# EAGLE design IR_Signal_Conditioning-v1.0 (EAGLE 6.4)
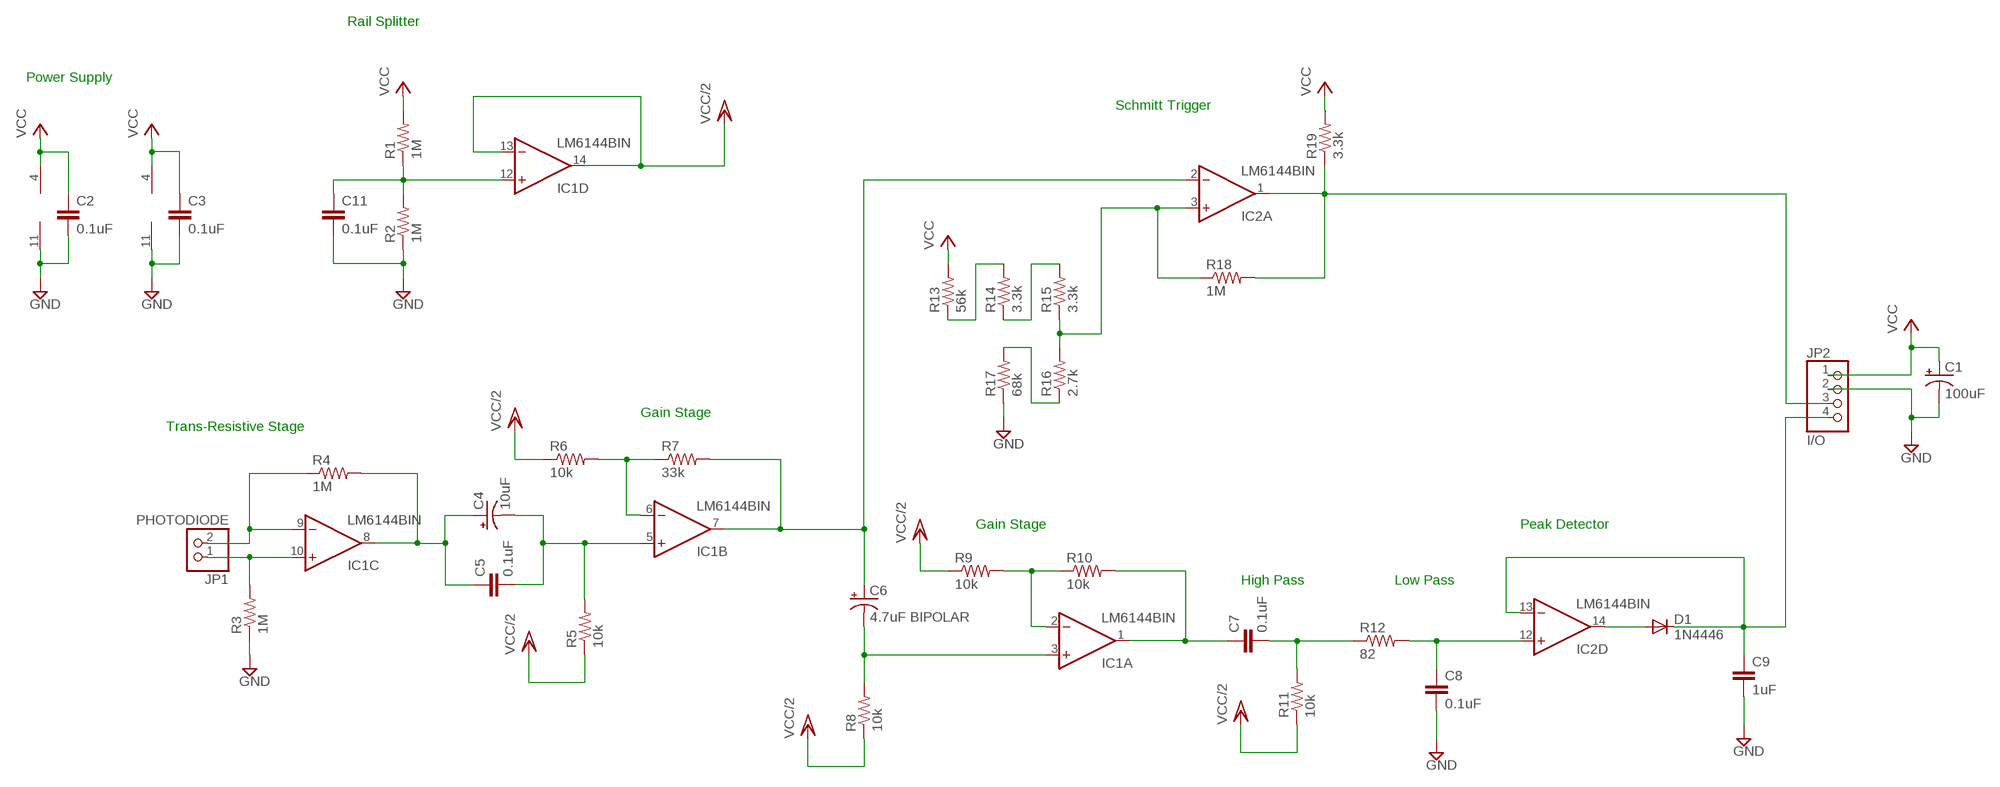
[diagram p0: schematic, sheet 1]

## Parts
C1  100uF  CPOL-USE2-5  [E2-5]
C2  0.1uF  C-EUC0805  [C0805]
C3  0.1uF  C-EUC0805  [C0805]
C4  10uF  CPOL-USE2-5  [E2-5]
C5  0.1uF  C-EUC0805  [C0805]
C6  4.7uF BIPOLAR  CPOL-USE2-5  [E2-5]
C7  0.1uF  C-EUC0805  [C0805]
C8  0.1uF  C-EUC0805  [C0805]
C9  1uF  C-EUC0805  [C0805]
C11  0.1uF  C-EUC0805  [C0805]
D1  1N4446  [DO35-10]
IC1  LM6144BIN  LM2902N  [DIL14]
IC2  LM6144BIN  LM2902N  [DIL14]
JP1  PHOTODIODE  PINHD-1X2  [1X02]
JP2  I/O  PINHD-1X4  [1X04]
R1  1M  R-US_R0805  [R0805]
R2  1M  R-US_R0805  [R0805]
R3  1M  R-US_R0805  [R0805]
R4  1M  R-US_R0805  [R0805]
R5  10k  R-US_R0805  [R0805]
R6  10k  R-US_R0805  [R0805]
R7  33k  R-US_R0805  [R0805]
R8  10k  R-US_R0805  [R0805]
R9  10k  R-US_R0805  [R0805]
R10  10k  R-US_R0805  [R0805]
R11  10k  R-US_R0805  [R0805]
R12  82  R-US_R0805  [R0805]
R13  56k  R-US_R0805  [R0805]
R14  3.3k  R-US_R0805  [R0805]
R15  3.3k  R-US_R0805  [R0805]
R16  2.7k  R-US_R0805  [R0805]
R17  68k  R-US_R0805  [R0805]
R18  1M  R-US_R0805  [R0805]
R19  3.3k  R-US_R0805  [R0805]

## Nets
GND: C1.- C2.2 C3.2 C8.2 C9.2 C11.2 IC1.11(P:V-) IC2.11(P:V-) JP2.2 R2.1 R3.1 R17.1
N$1: IC1.10(C:+IN) JP1.1 R3.2
N$2: IC1.9(C:-IN) JP1.2 R4.1
N$3: C4.+ C5.1 IC1.8(C:OUT) R4.2
N$4: C4.- C5.2 IC1.5(B:+IN) R5.2
N$5: IC1.6(B:-IN) R6.2 R7.1
N$6: C6.+ IC1.7(B:OUT) IC2.2(A:-IN) R7.2
N$7: C6.- IC1.3(A:+IN) R8.2
N$8: IC1.2(A:-IN) R9.2 R10.1
N$9: C7.1 IC1.1(A:OUT) R10.2
N$10: C7.2 R11.2 R12.1
N$11: D1.A IC2.14(D:OUT)
N$12: C8.1 IC2.12(D:+IN) R12.2
N$13: C9.1 D1.C IC2.13(D:-IN) JP2.4
N$14: R13.1 R14.2
N$15: R14.1 R15.2
N$16: IC2.3(A:+IN) R15.1 R16.2 R18.1
N$17: R16.1 R17.2
N$18: IC2.1(A:OUT) JP2.3 R18.2 R19.1
N$19: C11.1 IC1.12(D:+IN) R1.1 R2.2
VCC: C1.+ C2.1 C3.1 IC1.4(P:V+) IC2.4(P:V+) JP2.1 R1.2 R13.2 R19.2
VCC/2: IC1.13(D:-IN) IC1.14(D:OUT) R5.1 R6.1 R8.1 R9.1 R11.1
Unconnected: IC2.5(B:+IN) IC2.6(B:-IN) IC2.7(B:OUT) IC2.8(C:OUT) IC2.9(C:-IN) IC2.10(C:+IN)

## Notes on the sheet
- Rail Splitter
- Power Supply
- Schmitt Trigger
- Gain Stage
- Trans-Resistive Stage
- Gain Stage | Peak Detector
- High Pass | Low Pass

## Library data of the parts
C1 C4 C6 = rcl:CPOL-US: POLARIZED CAPACITOR, American symbol
C2 C3 C5 C7-C9 C11 = rcl:C-EU: CAPACITOR, European symbol
D1 = diode:1N4446: DIODE high speed (Philips)
IC1 IC2 = linear:LM2902: Low power quad operational amplifier Source: Data sgeet <http://www.st.com/internet/com/TECHNICAL_RESOURCES/TECHNICAL_LITERATURE/DATASHEET/CD00000533.pdf>
JP1 = pinhead:PINHD-1X2: PIN HEADER
JP2 = pinhead:PINHD-1X4: PIN HEADER
R1-R19 = rcl:R-US_: RESISTOR, American symbol

## Board
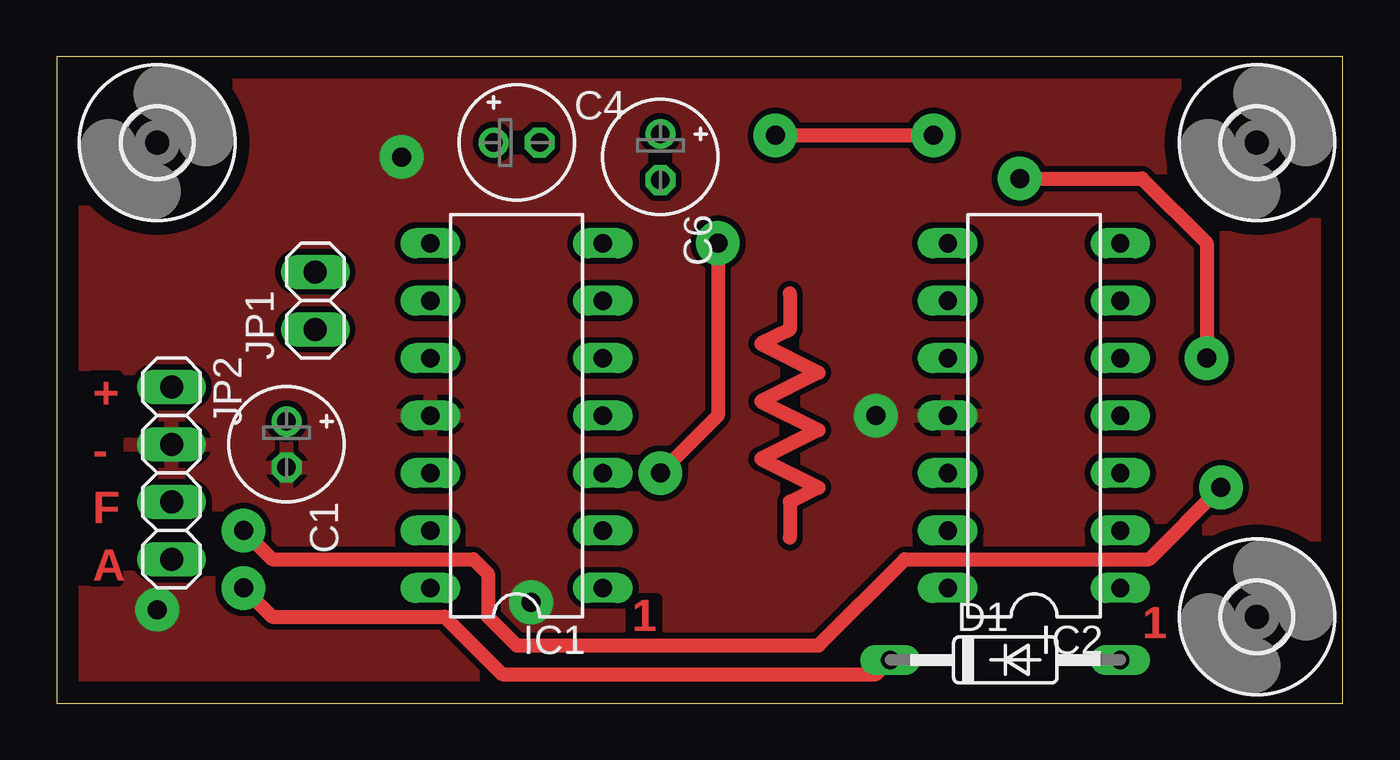
[diagram p1: board, top side]
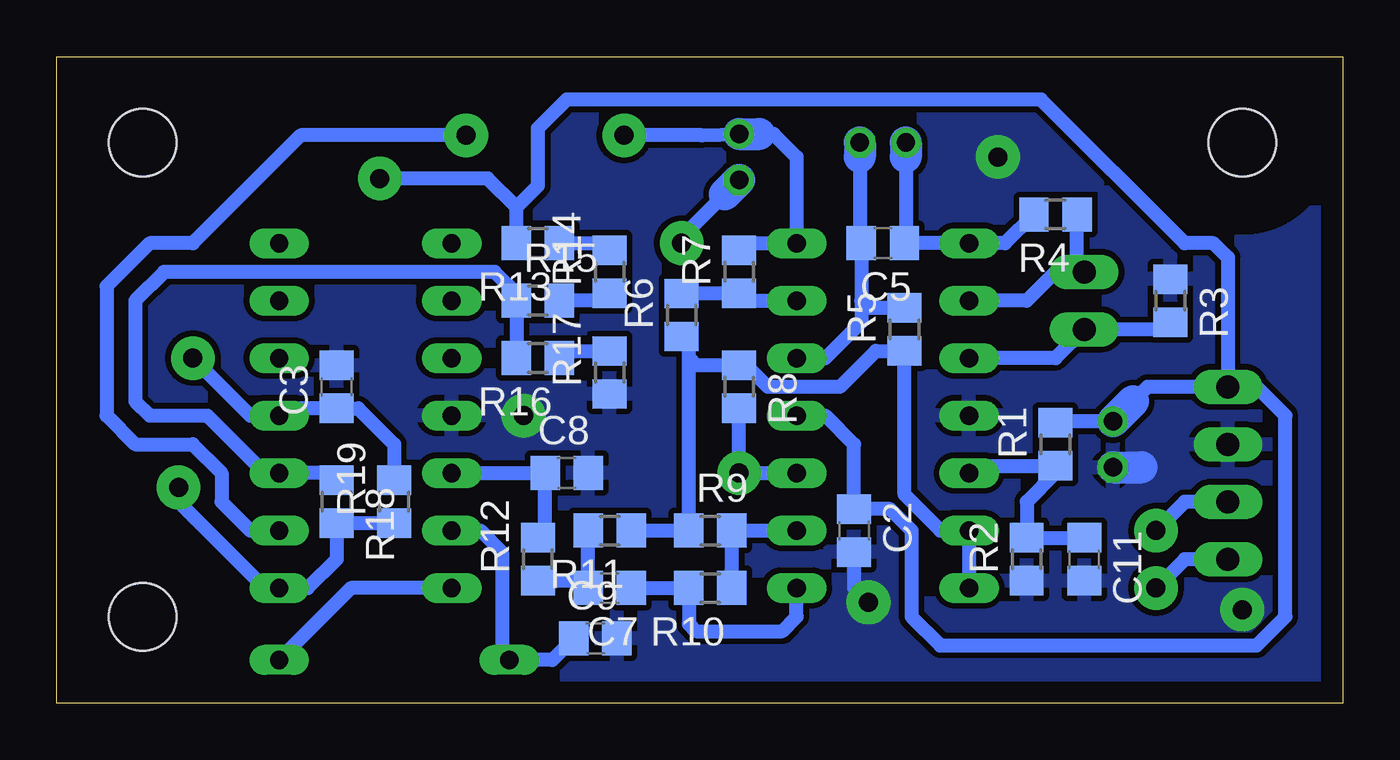
[diagram p2: board, bottom side, seen from below]

Size 56.82 x 28.57 mm. Coordinates in mm from the lower left corner, seen from the top.
Outline: 0,0 56.82,0 56.82,28.57 0,28.57 0,0
Copper layers (1*16): Top 0.035mm / dielectric 1.5mm / Bottom 0.035mm
Design rules "default *": minimum track width 10mil, minimum drill 24mil, track to track 10mil, track to pad 10mil, pad to pad 10mil, via to via 10mil, smd to smd 8mil, copper to edge 38mil, drill to drill 8mil, minimum pad ring 10mil, minimum via ring 8mil, stop-mask expansion 4mil, vias tented up to drill 0mil, thermal gap 10mil

### Footprints (pad centres in the part's own frame; a part is rotated, then mirrored left to right if it is on the bottom)
E2-5 = drill 0.813 pad 1.27: + -1.016,0 | drill 0.813 pad 1.27 octagon: - 1.016,0
C0805 = smd 1.3 x 1.5: 1 -0.95,0; 2 0.95,0
DO35-10 = drill 0.813 long: A 5.08,0; C -5.08,0
DIL14 = drill 0.813 long: 1 -7.62,-3.81; 2 -5.08,-3.81; 3 -2.54,-3.81; 4 0,-3.81; 5 2.54,-3.81; 6 5.08,-3.81; 7 7.62,-3.81; 8 7.62,3.81; 9 5.08,3.81; 10 2.54,3.81; 11 0,3.81; 12 -2.54,3.81; 13 -5.08,3.81; 14 -7.62,3.81
1X02 = drill 1.016 long: 1 -1.27,0; 2 1.27,0
1X04 = drill 1.016 long: 1 -3.81,0; 2 -1.27,0; 3 1.27,0; 4 3.81,0
R0805 = smd 1.3 x 1.5: 1 -0.95,0; 2 0.95,0
3,0 = hole 3: 0,0

### Placement (x,y rotation side)
C1  10.16,11.43 270 top
C2  21.59,7.62 270 bottom
C3  44.45,13.97 90 bottom
C4  20.32,24.77 0 top
C5  20.32,20.32 180 bottom
C6  26.67,24.13 270 top
C7  32.38,5.08 180 bottom
C8  34.29,10.16 0 bottom
C9  33.02,2.86 0 bottom
C11  11.43,6.35 270 bottom
D1  41.91,1.91 0 top
IC1  20.32,12.7 90 top
IC2  43.18,12.7 90 top
JP1  11.43,17.78 90 top
JP2  5.08,10.16 270 top
R1  12.7,11.43 90 bottom
R2  13.97,6.35 90 bottom
R3  7.62,17.78 270 bottom
R4  12.7,21.59 180 bottom
R5  19.37,16.51 90 bottom
R6  29.21,17.14 90 bottom
R7  26.67,19.05 90 bottom
R8  26.67,13.97 270 bottom
R9  27.94,7.62 0 bottom
R10  27.94,5.08 180 bottom
R11  32.38,7.62 180 bottom
R12  35.56,6.35 90 bottom
R13  35.56,20.32 180 bottom
R14  32.38,19.05 90 bottom
R15  35.56,17.78 0 bottom
R16  35.56,15.24 180 bottom
R17  32.38,14.61 90 bottom
R18  44.45,8.89 270 bottom
R19  41.91,8.89 90 bottom
U$1  [3,0]  53.02,24.77 0 top
U$2  [3,0]  4.45,24.77 0 top
U$3  [3,0]  53.02,3.81 0 top

### Tracks (layer width: path | path; a pad name or v marks a point on that pad's centre or on a via)
GND  (via drill 0.84 pad 1.93)
  Bottom 0.61: C2.2 21.59,5.08 v20.95,4.45
  Bottom 1.422: C1.- 8.89,10.41
  other vias: 36.2,12.7 15.24,24.13 4.45,4.13
  pour Bottom: 0,28.57 0,0 57.15,0 57.15,28.57
  pour Top: -0.64,29.21 -0.64,-0.64 57.78,-0.64 57.78,29.21
N$1
  Bottom 0.61: R3.2 7.94,16.51 JP1.1 12.7,15.24 IC1.10
N$2
  Bottom 0.61: IC1.9 13.97,17.78 12.7,19.05 JP1.2 11.75,19.37 R4.1
N$3
  Bottom 0.61: R4.2 14.92,20.32 IC1.8 C5.1 19.3,20.32 19.3,24.13
  Bottom 0.813: C5.1 19.3,20.39
  Bottom 1.422: C4.+ 19.3,24.13
N$4
  Bottom 0.61: 21.27,17.78 C5.2 21.34,20.32 21.34,24.13 | 21.27,17.78 21.27,16.83 22.86,15.24 IC1.5 | R5.2 20.95,17.46 21.27,17.78
  Bottom 0.813: C5.2 21.34,20.39
  Bottom 1.422: C4.- 21.34,24.13
N$5
  Bottom 0.61: IC1.6 26.35,17.78 R7.1 R6.2
  Bottom 0.813: R6.2
N$6  (via drill 0.84 pad 1.93)
  Top 0.61: v31.75,25.08 v38.73,25.08
  Bottom 0.61: R7.2 26.35,20.32 IC1.7 24.13,24.13 25.15,25.15 25.78,25.15 | IC2.2 48.26,7.62 49.53,8.89 49.53,10.16 50.8,11.43 53.34,11.43 54.61,12.7 54.61,18.41 52.7,20.32 50.8,20.32 46.04,25.08 v38.73,25.08 | C6.+ 28.32,25.08 v31.75,25.08
  Bottom 1.422: C6.+ 25.78,25.15
N$7  (via drill 0.84 pad 1.93)
  Top 0.61: v29.21,20.32 29.21,12.7 v26.67,10.16
  Bottom 0.61: R8.2 v26.67,10.16 IC1.3 | v29.21,20.32 29.21,20.57 27.3,22.48
  Bottom 1.422: C6.- 27.3,22.48
N$8
  Bottom 0.61: IC1.2 R9.2 R10.1
N$9
  Bottom 0.61: IC1.1 24.13,3.81 24.77,3.17 28.57,3.17 28.89,3.49 R10.2 C7.1
N$10
  Bottom 0.61: R11.2 C7.2 33.66,5.4 R12.1
N$11
  Bottom 0.61: IC2.14 43.81,5.08 D1.A
N$12
  Bottom 0.61: R12.2 35.24,7.62 C8.1 IC2.12
N$13  (via drill 0.84 pad 1.93)
  Top 0.61: v8.26,5.08 9.53,3.81 17.14,3.81 19.68,1.27 36.2,1.27 D1.C
  Bottom 0.61: JP2.4 6.99,6.35 v8.26,5.08 | IC2.13 38.1,7.62 37.15,6.67 37.15,2.22 D1.C 34.92,1.91 C9.1
N$14
  Bottom 0.61: R13.1 32.7,20.32 R14.2
N$15
  Bottom 0.61: R14.1 32.7,18.1 33.02,17.78 R15.2
N$16
  Bottom 0.61: R18.1 44.77,10.16 IC2.3 47.62,10.16 50.16,12.7 52.7,12.7 53.34,13.34 53.34,17.78 52.07,19.05 37.47,19.05 36.51,18.09 R15.1 R16.2
N$17
  Bottom 0.61: R16.1 34.3,15.55 R17.2
N$18  (via drill 0.84 pad 1.93)
  Top 0.61: v8.26,7.62 9.53,6.35 18.41,6.35 19.05,5.71 19.05,3.81 20.32,2.54 33.66,2.54 37.47,6.35 48.26,6.35 v51.44,9.53
  Bottom 0.61: R19.1 R18.2 44.45,6.35 45.72,5.08 IC2.1 47.62,5.08 51.44,8.89 v51.44,9.53 | JP2.3 6.99,8.89 v8.26,7.62
N$19
  Bottom 0.61: C11.1 R2.2 13.97,8.89 12.7,10.16 R1.1 16.19,10.48 IC1.12
N$20
  Top 0.61: 32.38,18.1 32.38,16.51 31.11,15.88 33.66,14.61 31.11,13.34 33.66,12.06 31.11,10.79 33.66,9.53 32.38,8.89 32.38,7.3
VCC  (via drill 0.84 pad 1.93)
  Top 0.61: v42.55,23.18 47.94,23.18 50.8,20.32 v50.8,15.24
  Bottom 0.61: C1.+ 12.63,12.45 | IC1.4 22.86,12.7 21.59,11.43 C2.1 20,8.57 19.05,7.62 19.05,3.81 17.78,2.54 3.81,2.54 2.54,3.81 2.54,12.7 3.81,13.97 JP2.1 | JP2.1 8.64,13.97 9.27,13.34 | R13.2 36.51,21.91 | 36.51,21.91 35.56,22.86 35.56,25.4 34.29,26.67 13.34,26.67 6.99,20.32 5.71,20.32 5.08,19.68 JP2.1 | 36.51,21.91 37.78,23.18 v42.55,23.18 | v50.8,15.24 48.26,12.7 IC2.4 46.67,13.02 C3.1 43.5,13.02 41.91,11.43 R19.2
  Bottom 0.813: 12.63,12.45 R1.2
  Bottom 1.422: 9.27,13.34 C1.+
VCC/2
  Bottom 0.61: IC1.14 IC1.13 17.78,7.62 19.37,9.21 R5.1 20.64,15.56 22.23,13.97 25.4,13.97 26.35,14.92 R8.1 28.57,14.92 28.89,15.24 | 28.89,15.24 R9.1 R11.1 | 28.89,15.24 28.89,15.88 R6.1

### Text on the board
Top: + | - | F | A | 1 | 1